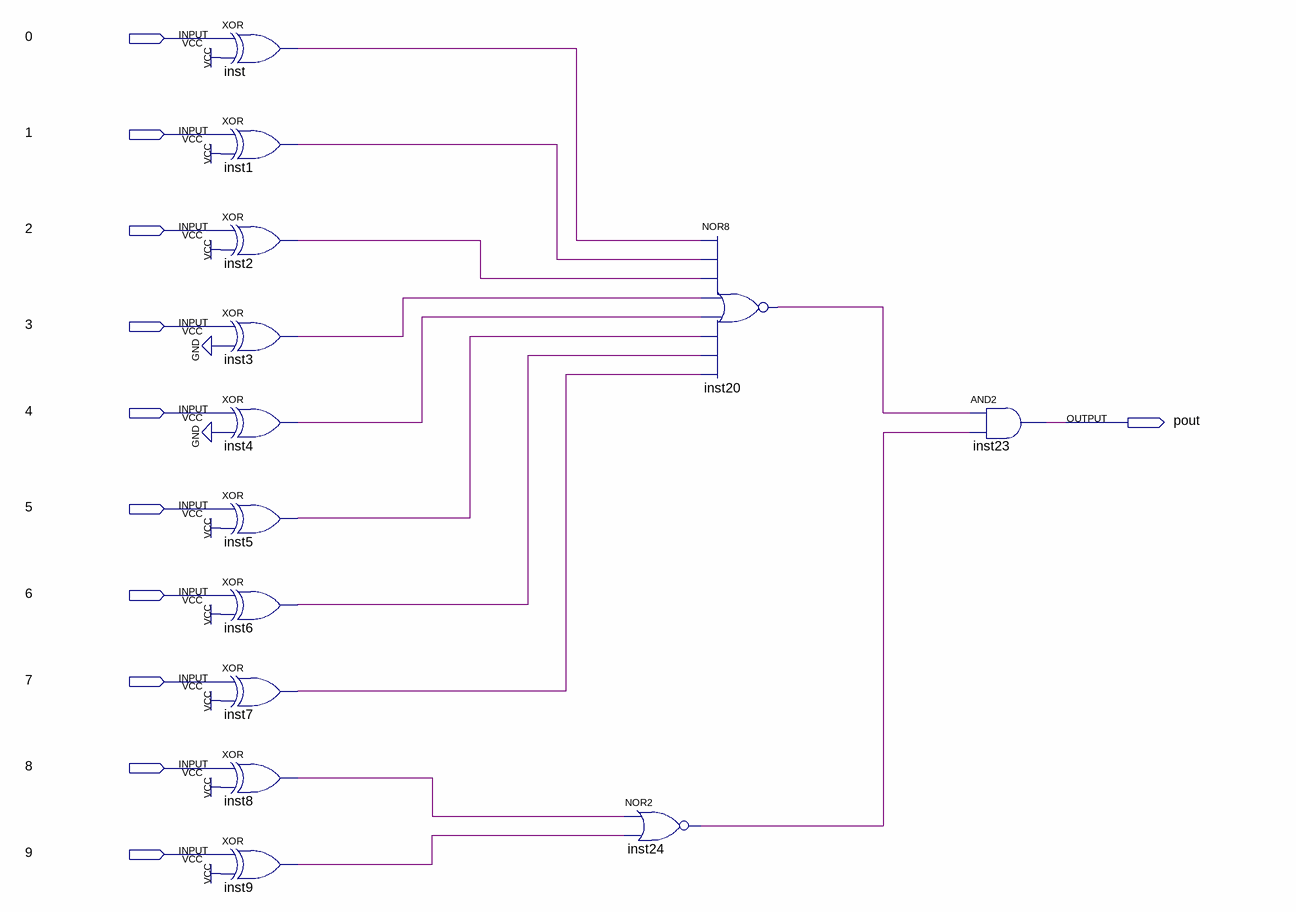
[diagram p0: schematic sheet]
// Quartus schematic 999.bdf as structural Verilog: 13 symbols, 11 pins
module \999  (
  input  \0 ,
  input  \1 ,
  input  \2 ,
  input  \3 ,
  input  \4 ,
  input  \5 ,
  input  \6 ,
  input  \7 ,
  input  \8 ,
  input  \9 ,
  output pout
);

  wire inst1_out, inst2_out, inst3_out, inst4_out, inst5_out, inst6_out, inst7_out, inst8_out, inst9_out,
       inst20_out, inst24_out, inst_out;

  xor inst (inst_out, \0 , 1'b1);
  xor inst1 (inst1_out, \1 , 1'b1);
  xor inst2 (inst2_out, \2 , 1'b1);
  xor inst3 (inst3_out, \3 , 1'b0);
  xor inst4 (inst4_out, \4 , 1'b0);
  xor inst5 (inst5_out, \5 , 1'b1);
  xor inst6 (inst6_out, \6 , 1'b1);
  xor inst7 (inst7_out, \7 , 1'b1);
  xor inst8 (inst8_out, \8 , 1'b1);
  xor inst9 (inst9_out, \9 , 1'b1);
  nor inst24 (inst24_out, inst8_out, inst9_out);
  nor inst20 (inst20_out, inst_out, inst1_out, inst2_out, inst3_out, inst4_out, inst5_out, inst6_out, inst7_out);
  and inst23 (pout, inst20_out, inst24_out);
endmodule
